# Altium schematic sheet [SH][IR] V1.0.SchDoc
size A4
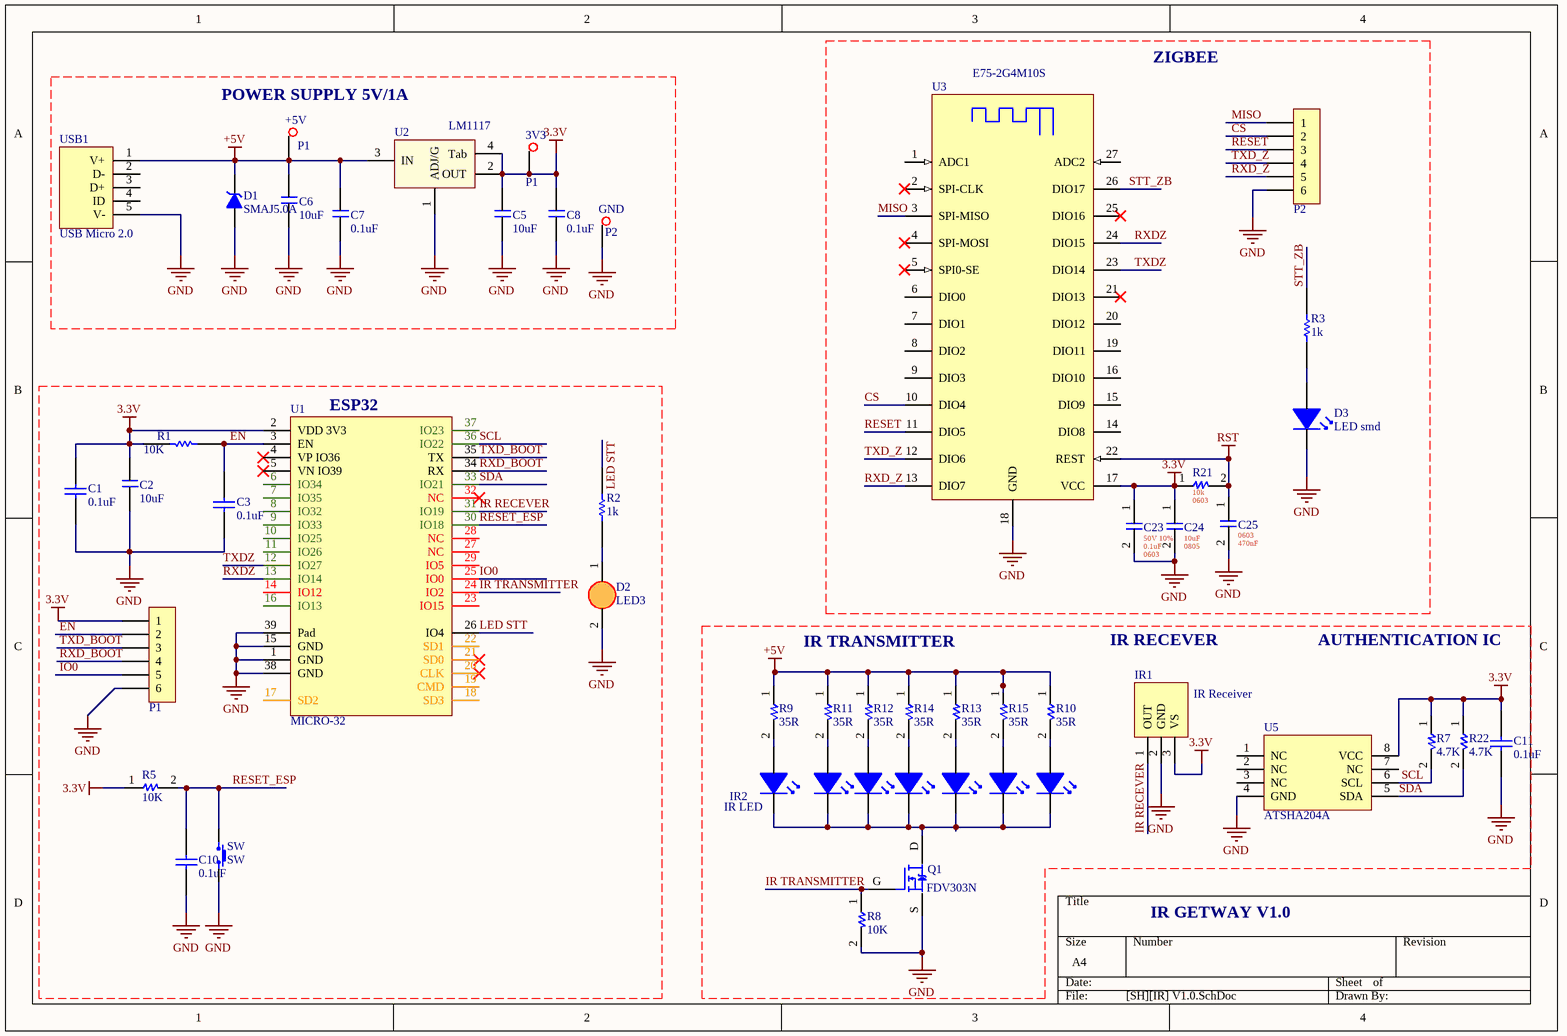
[diagram p0: [SH][IR] V1.0.SchDoc]

## Parts
3V3  P1  [TEXT_POINT]
+5V  P1  [TEXT_POINT]
C1  0.1uF  [0603 C]
C2  10uF  [0805 C]
C3  0.1uF  [0603 C]
C5  10uF  [0805 C]
C6  10uF  [0805 C]
C7  0.1uF  [0603 C]
C8  0.1uF  [0603 C]
C10  0.1uF  [0603 C]
C11  0.1uF  [0603 C]
C23  VOLTAGE + TOLE: 50V 10%  FP: 0603  [0603 C]  (hidden comment: 0.1uF)
C24  FP: 0805  [0805 C]  (hidden comment: 10uF)
C25  FP: 0603  [0603 C]  (hidden comment: 470nF)
D1  SMAJ5.0A  [DO214AC]
D2  LED3  [LED3mm]
D3  LED smd  [LED0603_1608]
GND  P2  [TEXT_POINT]
IR1  IR Receiver  [TSOP1838]
IR2  IR LED  [IR_LED7]
P1  P6  [P6 - 1.27MM]  (value not drawn)
P2  P6  [P6 - 1.27MM]  (value not drawn)
Q1  FDV303N  [SOT23-3]
R1  10K  [0603 R]
R2  1k  [0603 R]
R3  1k  [0603 R]
R5  10K  [0603 R]
R7  4.7K  [0603 R]
R8  10K  [0603 R]
R9  35R  [0603 R]
R10  35R  [0603 R]
R11  35R  [0603 R]
R12  35R  [0603 R]
R13  35R  [0603 R]
R14  35R  [0603 R]
R15  35R  [0603 R]
R21  FP: 0603  [0603 R]  (hidden comment: 10k)
R22  4.7K  [0603 R]
SW  SW  [BUTTON 4P]
U1  MICRO-32  [ESP MICRO 32]
U2  LM1117  [SOT223-4N]
U3  E75-2G4M10S  [NXP-E75-10S]
U5  ATSHA204A  [SOIC8]
USB1  USB Micro 2.0  [USB Micro 2.0]

## Nets
3.3V: 3V3.1(P) C1.2 C2.2 C5.2 C8.2 C11.2 C23.1 C24.1 IR1.3(VS) P1.1 R1.2 R5.1 R7.1 R21.1 R22.1 U1.2(VDD_3V3) U2.2(OUT) U2.4(Tab) U3.17(VCC) U5.8(VCC)
+5V: C6.2 C7.2 D1.2 R9.1 R10.1 R11.1 R12.1 R13.1 R14.1 R15.1 U2.3(IN) USB1.1(V+)
GND: C1.1 C2.1 C3.1 C5.1 C6.1 C7.1 C8.1 C10.1 C11.1 C23.2 C24.2 C25.2 D1.1 D2.2(K) D3.2 GND.1(P) IR1.2(GND) P1.6 P2.6 Q1.S R8.2 SW.2 U1.1(GND) U1.15(GND) U1.38(GND) U1.39(Pad) U2.1(ADJ/G) U3.18(GND) U5.4(GND) USB1.5(V-)
RST: C25.1 R21.2 U3.22(REST)
CS: P2.2 U3.10(DIO4)
EN: C3.2 P1.2 R1.1 U1.3(EN)
IO0: P1.5 U1.25(IO0)
IR RECEVER: IR1.1(OUT) U1.31(IO19)
IR TRANSMITTER: Q1.G R8.1 U1.24(IO2)
LED STT: R2.1 U1.26(IO4)
MISO: P2.1 U3.3(SPI-MISO)
RESET: P2.3 U3.11(DIO5)
RESET_ESP: C10.2 R5.2 SW.1 U1.30(IO18)
RXD_BOOT: P1.4 U1.34(RX)
RXD_Z: P2.5 U3.13(DIO7)
RXDZ: U1.13(IO14) U3.24(DIO15)
SCL: R7.2 U1.36(IO22) U5.6(SCL)
SDA: R22.2 U1.33(IO21) U5.5(SDA)
STT_ZB: R3.1 U3.26(DIO17)
TXD_BOOT: P1.3 U1.35(TX)
TXD_Z: P2.4 U3.12(DIO6)
TXDZ: U1.12(IO27) U3.23(DIO14)
NetD2_1: D2.1(A) R2.2
NetD3_1: D3.1 R3.2
NetIR2_1: IR2.1 R9.2
NetIR2_2: IR2.2 R11.2
NetIR2_3: IR2.3 R12.2
NetIR2_4: IR2.4 R14.2
NetIR2_5: IR2.5 R13.2
NetIR2_6: IR2.6 R15.2
NetIR2_7: IR2.7 R10.2
NetIR2_K: IR2.K Q1.D

Not connected (* = marked no-connect by the designer): +5V 1(P); U1 4(VP_IO36)* 5(VN_IO39)* 6(IO34) 7(IO35) 8(IO32) 9(IO33) 10(IO25) 11(IO26) 14(IO12) 16(IO13) 17(SD2) 18(SD3) 19(CMD) 20(CLK)* 21(SD0)* 22(SD1) 23(IO15) 27(NC) 28(NC) 29(IO5) 32(NC)* 37(IO23); U3 1(ADC1) 2(SPI-CLK)* 4(SPI-MOSI)* 5(SPI0-SE)* 6(DIO0) 7(DIO1) 8(DIO2) 9(DIO3) 14(DIO8) 15(DIO9) 16(DIO10) 19(DIO11) 20(DIO12) 21(DIO13)* 25(DIO16)* 27(ADC2); U5 1(NC) 2(NC) 3(NC) 7(NC); USB1 2(D-) 3(D+) 4(ID)

## Notes on the sheet
- (near +5V) POWER SUPPLY 5V/1A
- ZIGBEE
- (near U1) ESP32
- IR TRANSMITTER
- IR RECEVER
- AUTHENTICATION IC
- IR GETWAY V1.0

## Library data of the parts
C1 C3 C10 C11 = CAPACITOR NON POL
C2 C5-C8 = CAP NOP: PN: *
C23 = 0603 0.1uF CER: CAP CER 0.1uF 50V 10% 0603 SMD; PACKAGE: SMD; DATE: 04-Mar-21; CREATOR: MMUOP; ComponentLink1Description: New link; ComponentLink1URL: *; VALUE: 0.1uF
C24 = 0805 10uF CER: CAP CER 10uF 50V 10% 0805 SMD; VOLTAGE + TOLE: 50V 10%; PACKAGE: SMD; DATE: 04-Mar-21; CREATOR: MMUOP; ComponentLink1Description: New link; ComponentLink1URL: *; VALUE: 10uF
C25 = 0603 470nF CER: CAP CER 470nF 50V 10% 0603 SMD; VOLTAGE + TOLE: 50V 10%; PACKAGE: SMD; DATE: 04-Mar-21; CREATOR: MMUOP; ComponentLink1Description: New link; ComponentLink1URL: *; VALUE: 470nF
D1 = Diode Zener: Editor: MMUOP; Value: *; PN: *
D2 = LED 3mm
GND = P1
Q1 = MOSFET - N
R1-R3 = RESISTOR
R5 R7 R8 R22 = Res SMD
R9-R15 = Res SMD: Manufacture P/N: C0603CK
R21 = 0603 10k 1%: 10k 1% 0603 SMD; PN: C98220; PACKAGE: SMD; DATE: 04-Mar-21; CREATOR: MMUOP; ComponentLink1Description: New link; ComponentLink1URL: *; VOLTAGE + TOLE: 1%; VALUE: 10k
U1 = ESP MICRO-32
U2 = LM1117: 3v3; Value: LM317
U3 = ebyte - E75-2G4M10S
U5 = ATSHA204-A